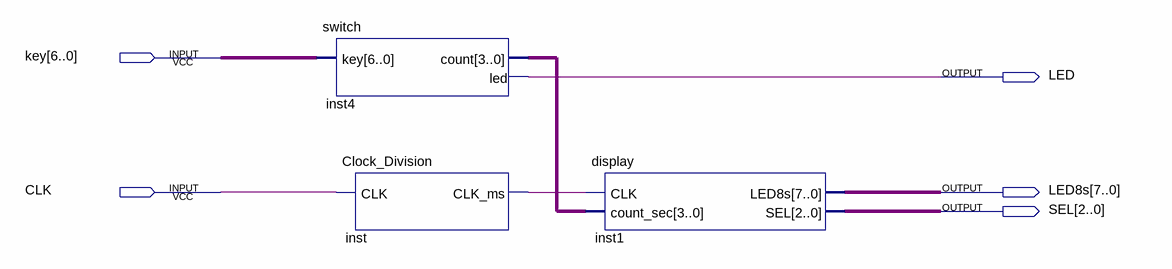
[diagram p0: schematic sheet]
// Quartus schematic bjq.bdf as structural Verilog: 3 symbols, 5 pins
module bjq (
  input  [6:0] key,
  input  CLK,
  output LED,
  output [7:0] LED8s,
  output [2:0] SEL
);

  wire inst_clk_ms;
  wire [3:0] inst4_count;

  switch inst4 (.key(key), .count(inst4_count), .led(LED));
  Clock_Division inst (.CLK(CLK), .CLK_ms(inst_clk_ms));
  display inst1 (.CLK(inst_clk_ms), .count_sec(inst4_count), .LED8s(LED8s), .SEL(SEL));
endmodule
